# Altium schematic sheet Sheet1_Updated_v4.SchDoc
size A3; SheetNumber: 1; SheetTotal: 1
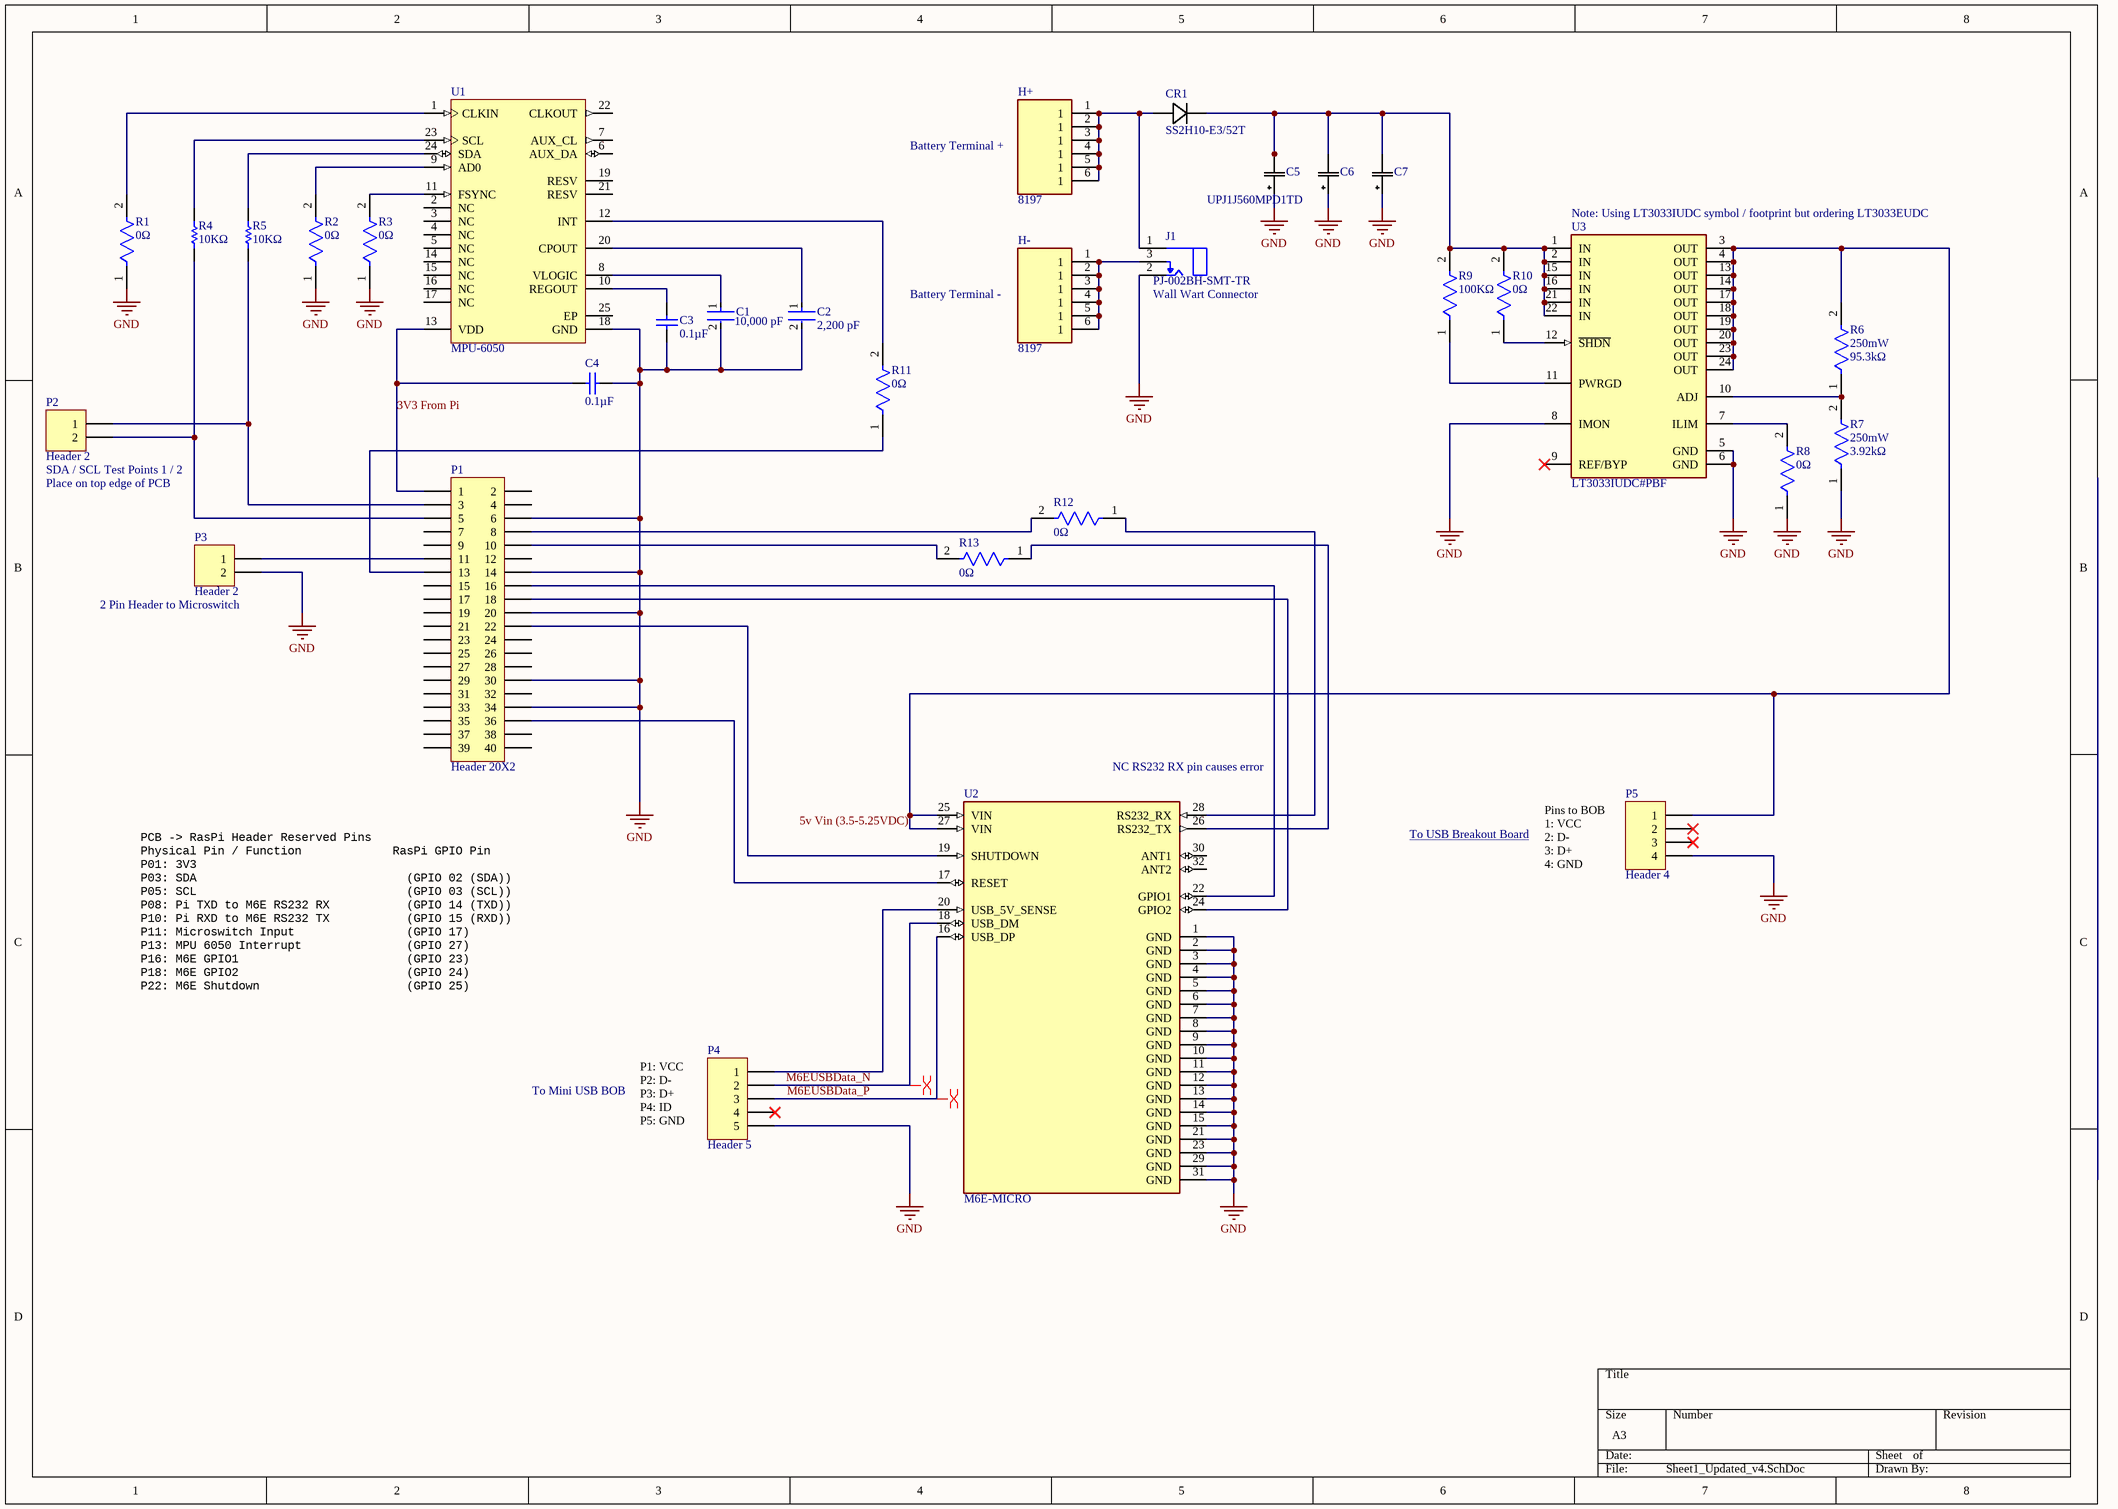
[diagram p0: Sheet1_Updated_v4.SchDoc]

## Parts
C1  Capacitance: 10,000 pF  [FP-C1206C-EB-MFG]  (hidden comment: C1206C103K1RACTU)
C2  value 2,200 pF  [FP-C1206C-EB-MFG]  (hidden comment: C1206C222K5RACTU)
C3  Capacitance: 0.1µF  [KEMT-1206-2_M]  (hidden comment: C1206C104K5RACTU)
C4  Capacitance: 0.1µF  [KEMT-1206-2_M]  (hidden comment: C1206C104K5RACTU)
C5  UPJ1J560MPD1TD  [CAP_UPJ_8X15_NCH]
C6  UPJ1J560MPD1TD  [CAP_UPJ_8X15_NCH]  (value not drawn)
C7  UPJ1J560MPD1TD  [CAP_UPJ_8X15_NCH]  (value not drawn)
CR1  SS2H10-E3/52T  [DIODE_DO214AA]
H+  8197  [KEYSTONE_8197]
H-  8197  [KEYSTONE_8197]
J1  PJ-002BH-SMT-TR  [FP-PJ-002BH-SMT-TR-MFG]
P1  Header 20X2  [HDR2X20]
P2  Header 2  [HDR1X2]
P3  Header 2  [HDR1X2]
P4  Header 5  [HDR1X5]
P5  Header 4  [HDR1X4]
R1  value 0Ω  [FP-RC1206-MFG]  (hidden comment: RC1206JR-070RL)
R2  value 0Ω  [FP-RC1206-MFG]  (hidden comment: RC1206JR-070RL)
R3  value 0Ω  [FP-RC1206-MFG]  (hidden comment: RC1206JR-070RL)
R4  Resistance: 10KΩ  [RESC3116X65X40ML10T20]  (hidden comment: RC1206FR-0710KL)
R5  Resistance: 10KΩ  [RESC3116X65X40ML10T20]  (hidden comment: RC1206FR-0710KL)
R6  Power Rating: 250mW  Resistance: 95.3kΩ  [FP-CRCW1206-e3-IPC_B]  (hidden comment: CRCW120695K3FKEA)
R7  Power Rating: 250mW  Resistance: 3.92kΩ  [FP-CRCW1206-e3-IPC_C]  (hidden comment: CRCW12063K92FKEA)
R8  value 0Ω  [FP-RC1206-MFG]  (hidden comment: RC1206JR-070RL)
R9  value 100KΩ  [FP-AC1206-MFG]  (hidden comment: AC1206FR-07100KL)
R10  value 0Ω  [FP-RC1206-MFG]  (hidden comment: RC1206JR-070RL)
R11  value 0Ω  [FP-RC1206-MFG]  (hidden comment: RC1206JR-070RL)
R12  value 0Ω  [FP-RC1206-MFG]  (hidden comment: RC1206JR-070RL)
R13  value 0Ω  [FP-RC1206-MFG]  (hidden comment: RC1206JR-070RL)
U1  MPU-6050  [IS-QFN-24_V]
U2  M6E-MICRO  [XCVR_M6E-MICRO]
U3  LT3033IUDC#PBF  [FP-UDC-20-05-08-1536-MFG]

## Nets
GND: C1.2 C2.2 C3.1 C4.1 C5.1 C6.1 C7.1 J1.2 P1.6 P1.14 P1.20 P1.30 P1.34 P3.2 P4.5 P5.4 R1.1 R2.1 R3.1 R7.1 R8.1 U1.18(GND) U2.1(GND) U2.2(GND) U2.3(GND) U2.4(GND) U2.5(GND) U2.6(GND) U2.7(GND) U2.8(GND) U2.9(GND) U2.10(GND) U2.11(GND) U2.12(GND) U2.13(GND) U2.14(GND) U2.15(GND) U2.21(GND) U2.23(GND) U2.29(GND) U2.31(GND) U3.5(GND) U3.6(GND) U3.8(IMON)
3V3 From Pi: C4.2 P1.1 U1.13(VDD)
5v Vin (3.5-5.25VDC): P5.1 R6.2 U2.25(VIN) U2.27(VIN) U3.3(OUT) U3.4(OUT) U3.13(OUT) U3.14(OUT) U3.17(OUT) U3.18(OUT) U3.19(OUT) U3.20(OUT) U3.23(OUT) U3.24(OUT)
M6EUSBData_N: P4.2 U2.18(USB_DM)
M6EUSBData_P: P4.3 U2.16(USB_DP)
NetC1_1: C1.1 U1.8(VLOGIC)
NetC2_1: C2.1 U1.20(CPOUT)
NetC3_2: C3.2 U1.10(REGOUT)
NetC5_2: C5.2 C6.2 C7.2 CR1.1 R9.2 R10.2 U3.1(IN) U3.2(IN) U3.15(IN) U3.16(IN) U3.21(IN) U3.22(IN)
NetCR1_2: CR1.2 H+.1 H+.2(1) H+.3(1) H+.4(1) H+.5(1) H+.6(1) J1.1
NetH-_1: H-.1 H-.2(1) H-.3(1) H-.4(1) H-.5(1) H-.6(1) J1.3
NetP1_3: P1.3 P2.1 R5.1
NetP1_5: P1.5 P2.2 R4.1
NetP1_8: P1.8 R12.2
NetP1_10: P1.10 R13.2
NetP1_11: P1.11 P3.1
NetP1_13: P1.13 R11.1
NetP1_16: P1.16 U2.22(GPIO1)
NetP1_18: P1.18 U2.24(GPIO2)
NetP1_22: P1.22 U2.19(SHUTDOWN)
NetP1_36: P1.36 U2.17(RESET)
NetP4_1: P4.1 U2.20(USB_5V_SENSE)
NetR1_2: R1.2 U1.1(CLKIN)
NetR2_2: R2.2 U1.9(AD0)
NetR3_2: R3.2 U1.11(FSYNC)
NetR4_2: R4.2 U1.23(SCL)
NetR5_2: R5.2 U1.24(SDA)
NetR6_1: R6.1 R7.2 U3.10(ADJ)
NetR8_2: R8.2 U3.7(ILIM)
NetR9_1: R9.1 U3.11(PWRGD)
NetR10_1: R10.1 U3.12(~{SHDN})
NetR11_2: R11.2 U1.12(INT)
NetR12_1: R12.1 U2.28(RS232_RX)
NetR13_1: R13.1 U2.26(RS232_TX)

Not connected (* = marked no-connect by the designer): P1 2 4 7 9 12 15 17 19 21 23 24 25 26 27 28 29 31 32 33 35 37 38 39 40; P4 4*; P5 2* 3*; U1 2(NC) 3(NC) 4(NC) 5(NC) 6(AUX_DA) 7(AUX_CL) 14(NC) 15(NC) 16(NC) 17(NC) 19(RESV) 21(RESV) 22(CLKOUT) 25(EP); U2 30(ANT1) 32(ANT2); U3 9(REF/BYP)*

## Layout directives
differential pair: M6EUSBData_N, M6EUSBData_P

## Notes on the sheet
- (near H+) Battery Terminal +
- (near U3) Note: Using LT3033IUDC symbol / footprint but ordering LT3033EUDC
- Battery Terminal -
- (near J1) Wall Wart Connector
- (near P2) SDA / SCL Test Points 1 / 2
- (near P2) Place on top edge of PCB
- (near P3) 2 Pin Header to Microswitch
- (near U2) NC RS232 RX pin causes error
- To USB Breakout Board <https://www.sparkfun.com/products/15100>
- Pins to BOB
  1: VCC
  2: D-
  3: D+
  4: GND
- PCB -> RasPi Header Reserved Pins
  Physical Pin / Function             RasPi GPIO Pin
  P01: 3V3
  P03: SDA                              (GPIO 02 (SDA))
  P05: SCL                              (GPIO 03 (SCL))
  P08: Pi TXD to M6E RS232 RX           (GPIO 14 (TXD))
  P10: Pi RXD to M6E RS232 TX           (GPIO 15 (RXD))
  P11: Microswitch Input                (GPIO 17)
  P13: MPU 6050 Interrupt               (GPIO 27)
  P16: M6E GPIO1                        (GPIO 23)
  P18: M6E GPIO2                        (GPIO 24)
  P22: M6E Shutdown                     (GPIO 25)
  P36: M6E Reset                        (GPIO 16)
- To Mini USB BOB
- P1: VCC
  P2: D-
  P3: D+
  P4: ID
  P5: GND

## Library data of the parts
C1 = CMP-03020-021723-1: Cap Ceramic 0.01uF 100V X7R 10% SMD 1206 125°C Plastic T/R; Manufacturer: KEMET; Temperature Coefficient: 15%; Tolerance: 0.1; Value: 10,000 pF; Automotive Grade: Grade 0; Device Class L3: Ceramic Capacitors; Ipc Land Pattern Name: CAPC320160X78; Temperature Characteristic: X7R; Material: Ceramic; Category: Cap; Device Class L2: Capacitors; RoHS: TRUE; Manufacturer Part Number: C1206C103K1RACTU; Mouser Description: Multilayer Ceramic Capacitors MLCC - SMD/SMT 100volts 10000pF X7R 10%; Octopart: https://octopart.com/c1206c103k1ractu-kemet-117927; Temperature: -55°C to +150°C; Temperature Range Low: -55°C; Lead Free: Yes; Automotive: Yes; ComponentLink2URL: https://content.kemet.com/datasheets/KEM_C1007_X8R_ULTRA_150C_SMD.pdf; Package: C1206C-EB; Voltage Rating: 100 V; Temperature Range High: +150°C; ComponentLink2Description: Datasheet; Height: 0.88mm; Device Class L1: Passive Components; Digikey Description: Cap Ceramic 0.01uF 100V X7R 10% SMD 1206 125°C Plastic T/R
C2 = CMP-03020-006263-1: CAP CER 2200PF 50V X7R 1206; Manufacturer: KEMET; Automotive Grade: Grade 0; Temperature Coefficient: 15%; Material: Ceramic; Tolerance: 0.1; ComponentLink2Description: Datasheet; Digikey Description: CAP CER 2200PF 50V X7R 1206; Temperature Range High: +150°C; ComponentLink2URL: https://content.kemet.com/datasheets/KEM_C1007_X8R_ULTRA_150C_SMD.pdf; RoHS: TRUE; Temperature Range Low: -55°C; Temperature Characteristic: X7R; Voltage Rating: 50 V; Temperature: -55°C to +150°C; Lead Free: Yes; Mouser Description: Multilayer Ceramic Capacitors MLCC - SMD/SMT 50volts 2200pF X7R 10%; Device Class L2: Capacitors; Category: Cap; Manufacturer Part Number: C1206C222K5RACTU; Device Class L1: Passive Components; Capacitance: 2,200 pF; Device Class L3: Ceramic Capacitors; Automotive: Yes; Height: 0.88mm; Ipc Land Pattern Name: CAPC320160X78; Octopart: https://octopart.com/c1206c222k5ractu-kemet-135692; Package: C1206C-EB
C3 C4 = CMP-1037-04202-2: CAP, Ceramic, 0.1 uF, +/- 10%, 50 V, -55 to 125 degC, 1206 (3216 Metric), RoHS, Tape and Reel; Manufacturer: Kemet; Voltage Rating: 50V; Product Range: KEMET-CSeries; SVHC: ToBeAdvised; Dielectric Characteristic: X7R; Capacitor Case Style: 1206[3216Metric]; Package Reference: 1206-2; Package Description: 2-Leads SMD, Body 3.2 x 1.6 mm; Packaging: Tape&Reel; Operating Temperature Max: 125degC; Capacitance Tolerance: ±10%; Datasheet URL: https://datasheet.ciiva.com/6125/1725438-6125494.pdf; Manufacturer URL: http://www.kemet.com/; Operating Temperature Min: -55degC; Datasheet Version: Jul-13
C5-C7 = UPJ1J560MPD1TD: No Description Available; Vendor: Nichicon; Built_By: EMA_Cory; SourceLibrary: Nichicon_2019-09-13; Type: DEV; Manufacturer_Part_Number: UPJ1J560MPD1TD; Copyright: Copyright (C) 2018 Accelerated Designs. All rights reserved; RefDes: RefDes
CR1 = SS2H10-E3/52T: No Description Available; Vendor: Vishay; Built_By: EMA_UL_Team; Type: DEV; Manufacturer_Part_Number: SS2H10-E3/52T; Copyright: Copyright (C) 2018 Accelerated Designs. All rights reserved; RefDes: RefDes
H+ H- = 8197: Magnet Neodymium Iron Boron _NdFeB_ 0.500 Dia x 0.750 H _12.7mm x 19.0mm_; MF: Radial Magnet; SnapEDA_Link: https://www.snapeda.com/parts/8197/Keystone%20Electronics/view-part/474380/?ref=snap; Availability: Unavailable; Value: *; Price: None; MP: 8197; Package: None
J1 = CMP-2000-06897-2: CONN PWR JACK 2.5X5.5MM SOLDER; Manufacturer: CUI Inc; Current Rating: 5A; Standoff Height: 0.1mm; Voltage Rating: 24V; Conn Gender: Male; Conn Orientation: Right Angle; Number Of Contacts: 3; Temperature Range Low: -25°C; Category: Conn; Package: 0; Device Class L2: Power Connectors; Contact Material: Nickel,Silver; Automotive: No; Mouser Description: 2.5 mm Center Pin, 5.0 A, Right Angle, Surface Mount (SMT), Dc Power Jack Connector; Device Class L3: unset; ComponentLink2URL: https://www.cuidevices.com/product/resource/digikeypdf/pj-002bh-smt-tr.pdf; Octopart: https://octopart.com/pj-002bh-smt-tr-cui-25947151; Manufacturer Part Number: PJ-002BH-SMT-TR; Lead Free: Yes; ComponentLink2Description: Datasheet; Digikey Description: CONN PWR JACK 2.5X5.5MM SOLDER; Height: 11.43mm; Temperature: -25°C to +85°C; RoHS: TRUE; Device Class L1: Connectors; Temperature Range High: +85°C
P1 = Header 20X2: Header, 20-Pin, Dual row; LatestRevisionDate: 17-Jul-2002; LatestRevisionNote: Re-released for DXP Platform.; Publisher: Altium Limited
P2 P3 = Header 2: Header, 2-Pin; LatestRevisionDate: 17-Jul-2002; LatestRevisionNote: Re-released for DXP Platform.; Publisher: Altium Limited
P4 = Header 5: Header, 5-Pin; LatestRevisionDate: 17-Jul-2002; LatestRevisionNote: Re-released for DXP Platform.; Publisher: Altium Limited
P5 = Header 4: Header, 4-Pin; LatestRevisionDate: 17-Jul-2002; LatestRevisionNote: Re-released for DXP Platform.; Publisher: Altium Limited
R1-R3 R8 R10-R13 = CMP-2100-03681-2: RES SMD 0 OHM JUMPER 1/4W 1206; Manufacturer: YAGEO; Voltage Rating: 200V; Temperature Coefficient: 300ppm/°C; Power Rating: 0.25W; Tolerance: 5%; Manufacturer Part Number: RC1206JR-070RL; Temperature Range Low: -55°C; Category: Res; Automotive: No; Ipc Land Pattern Name: RESC310160X55; Device Class L1: Passive Components; Temperature: -55°C to +155°C; ComponentLink2URL: https://www.yageo.com/upload/media/product/productsearch/datasheet/rchip/PYu-RC_Group_51_RoHS_L_10.pdf; Lead Free: Yes; Height: 0.65mm; Footprint Url: https://www.yageo.com/upload/website/yageo_PYu-R_Mount_10_19050818_343.pdf; Package: RC1206; Digikey Description: RES SMD 0 OHM JUMPER 1/4W 1206; Temperature Range High: +155°C; Device Class L3: Chip SMD Resistors; Device Class L2: Resistors; Octopart: https://octopart.com/rc1206jr-070rl-yageo-40025601; Resistance: 0Ω; Series: RC; ComponentLink2Description: Datasheet; Composition: Thick Film; RoHS: TRUE; Mouser Description: Resistor: thick film; SMD; 1206; 0O; 0.25W; ±5%; -55÷155°C
R4 R5 = CMP-1014-00623-2: Chip Resistor, 10 KOhm, +/- 1%, 0.25 W, -55 to 155 degC, 1206 (3216 Metric), RoHS, Tape and Reel; Manufacturer: Yageo; Voltage Rating: 200V; Temperature Coefficient: 100ppm/degreesC; Power Rating: 250mW; Packaging: TapeandReel; Termination: SMD/SMT; REACH SVHC: Unknown; Tolerance: 1%; Height: 0.55mm; Composition: ThickFilm; Max Operating Temperature: 155degC; Datasheet Version: Rev. 5, 10/2016; Lead Free: LeadFree; Case Code (Metric): 3216; Depth: 1.6mm; Package Quantity: 5000; RoHSCompliant: true; Military Standard: Not; Case/Package: 1206; Case Code (Imperial): 1206; Min Operating Temperature: -55degC; Datasheet URL: http://www.yageo.com/NewPortal/yageodocoutput?fileName=/pdf/R-Chip/PYu-RC_Group_51_RoHS_L_5.pdf; Length: 3.1mm; Manufacturer URL: http://www.yageo.com/; Package Reference: 1206.0; Width: 1.6mm; Package Description: 2-Pin Surface Mount Device, Body 3.1 x 1.6 mm
R6 = CMP-02407-004492-1: RES Thick Film, 95.3kΩ, 1%, 0.25W, 100ppm/°C, 1206; Voltage Rating (DC): 200V; Number of Terminations: 2; Depth: 1.6mm; Case Code (Metric): 3216; Military Standard: Not; Contact Plating: Tin; Case Code (Imperial): 1206; Max Operating Temperature: 155°C; Number of Pins: 2; Width: 0.063inch; Packaging: Tape and Reel; Tolerance: 1%; Composition: Thick Film; Height: 0.024inch; Package Quantity: 10; Min Operating Temperature: -55°C; Lead Free: Lead Free; Temperature Coefficient: 100ppm/°C; Max Power Dissipation: 250mW; Voltage Rating: 200V; Radiation Hardening: No; Length: 3.2mm; Weight: 0.000353oz; Case/Package: 1206; Features: Automotive AEC-Q200
R7 = CMP-2003-02162-2: RES Thick Film, 3.92kΩ, 1%, 0.25W, 100ppm/°C, 1206; Voltage Rating (DC): 200V; Height: 0.55mm; Package Quantity: 10; Voltage Rating: 200V; Lead Free: Lead Free; Min Operating Temperature: -55°C; Temperature Coefficient: 100ppm/°C; Number of Pins: 2; Military Standard: Not; Composition: Thick Film; Contact Plating: Tin; Number of Terminations: 2; Case/Package: 1206; Width: 1.6mm; Case Code (Metric): 3216; Features: Automotive AEC-Q200; Radiation Hardening: No; Termination: SMD/SMT; Max Power Dissipation: 250mW; Weight: 0.000353oz; Tolerance: 1%; Max Operating Temperature: 155°C; Length: 3.2mm; Case Code (Imperial): 1206; Packaging: Tape and Reel; Depth: 1.6mm
R9 = CMP-2003-04909-2: RES SMD 100K OHM 1% 1/4W 1206; Manufacturer: Yageo; Power Rating: 0.25W; Voltage Rating: 200V; Automotive Grade: Grade 0; Tolerance: 0.01; Mouser Description: RES SMD 100K OHM 1% 1/4W 1206; Ipc Land Pattern Name: RESC310160X55; Temperature Range Low: -55°C; Package: AC1206; Temperature: -55°C to +155°C; Device Class L3: Chip SMD Resistors; Resistance: 100KΩ; Lead Free: Yes; Temperature Range High: +155°C; Series: AC; Octopart: https://octopart.com/ac1206fr-07100kl-yageo-21711116; Height: 0.65mm; Footprint Url: http://www.yageo.com/exep/pages/download/literatures/PYu-R_Mount_10.pdf; RoHS: TRUE; Manufacturer Part Number: AC1206FR-07100KL; Category: Res; Automotive: Yes; Composition: Thick Film; Device Class L2: Resistors; ComponentLink2URL: http://www.yageo.com/NewPortal/yageodocoutput?fileName=/pdf/R-Chip/PYu-AC_51_RoHS_L_6.pdf; Digikey Description: RES SMD 100K OHM 1% 1/4W 1206; ComponentLink2Description: Datasheet; Device Class L1: Passive Components
U1 = CMP-1753-00002-2: 3-Axis Gyroscope, Accelerometer and a Digital Motion Processor(TM) (DMP), 2.375 to 3.46 V, -40 to 85 degC, 24-Pin QFN, RoHS, Tape and Reel; Manufacturer: InvenSense; Featured Product: MPU-60506-Axis,IntegratedI²CSolution; Other Names: 1428-1007-2 / MPU6050; Sensor Type: MotionTracking; Online Catalog: MPU-6000™Series; Unit PriceUSD: Digital; Datasheet Version: Rev. 3.3, 05/2012; Category: Sensors,Transducers; Datasheet URL: http://datasheet.octopart.com/MPU-6050-InvenSense-datasheet-14421344.pdf; Family: Multifunction; Standard Package: 5,000; Manufacturer URL: http://www.invensense.com/; Output Type: Digital; Dynamic Catalog: MPU-6000™Series
U2 = M6E-MICRO: KIT DEVELOPMENT M6E MICRO-LTE; MF: ThingMagic, a; MP: M6E-MICRO; DigiKey-Purchase-URL: https://snapeda.com/shop?store=DigiKey&id=791113; Package: Module Thingmagic; Price: None; Value: *; SnapEDA_Link: https://www.snapeda.com/parts/M6E-MICRO/ThingMagic,%20a%20JADAK%20brand/view-part/791113/?ref=snap; Availability: Warning; Check_prices: https://www.snapeda.com/parts/M6E-MICRO/ThingMagic,%20a%20JADAK%20brand/view-part/791113/?ref=eda
U3 = CMP-09138-000006-1: IC REG LINEAR POS ADJ 3A 20QFN; Manufacturer: Analog Devices; Number Of Outputs: 1; Min Supply Voltage: 0.95V; Max Supply Voltage: 10V; Output Type: AdjustableProgrammable; Dropout Voltage: 95mV; Output Voltage: 0.2-9.7V; Standoff Height: 0mm; Nominal Supply Current: 1.9-27mA; Max Junction Temp: +125°C; Manufacturer Part Number: LT3033IUDC#PBF; Package: UDC-20-05-08-1536; Temperature Range Low: -40°C; Device Class L2: Power Management ICs; Height: 0.8mm; Lead Free: Yes; Automotive: No; Device Class L3: Voltage Regulators - Linear; ComponentLink2Description: Datasheet; ComponentLink2URL: https://www.analog.com/media/en/technical-documentation/data-sheets/LT3033.pdf; Temperature: -40°C to +125°C; RoHS: TRUE; Digikey Description: IC REG LINEAR POS ADJ 3A 20QFN; Category: IC; Output Current: 3A; Temperature Range High: +125°C; Device Class L1: Integrated Circuits (ICs); Octopart: https://octopart.com/lt3033iudc%23pbf-analog+devices-95403585